# Altium schematic sheet FPGA.schdoc: Kasli-DIOT
size 420 x 297 mm; EDA_Number: ARTIQ; Projet: ARTIQ/SINARA; Author: G.Kasprowicz; CompanyName: WUT ISE; DrawnBy: F.Świtakowski; Organization: WUT ISE; Address1: PW ISE; Address2: Nowowiejska 15/19 00-665 Warsaw; Address3: gkasprow@gmail.com; Revision: 1; SheetNumber: -; SheetTotal: -; ModifiedBy: -; CheckedDate: -; Title2: FPGA; DivGrp: WUT ISE; Designer: F.Świtakowski; ModifiedDate: -; ProjectName: Sensor Box
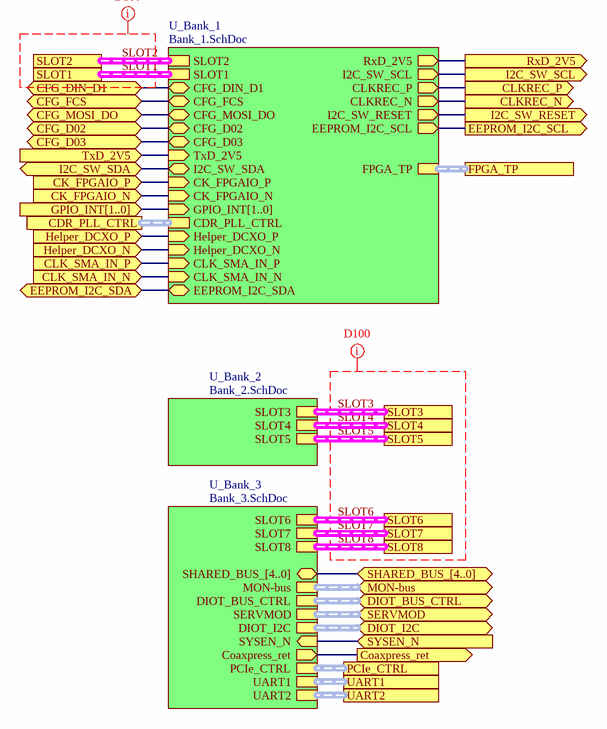
[diagram p0: FPGA.schdoc]

## Sub-sheets
U_Bank_1 = Bank_1.SchDoc: SLOT2 (harness SLOT), SLOT1 (harness SLOT), CFG_DIN_D1 (bidir), CFG_FCS (bidir), CFG_MOSI_DO (bidir), CFG_D02 (bidir), CFG_D03 (bidir), RxD_2V5 (out), TxD_2V5 (in), I2C_SW_SCL (out), I2C_SW_SDA (bidir), CK_FPGAIO_P (in), CK_FPGAIO_N (in), CLKREC_P (out), CLKREC_N (out), GPIO_INT[1..0] (in), CDR_PLL_CTRL (harness CDR_PLL_CTRL), Helper_DCXO_P (in), Helper_DCXO_N (in), I2C_SW_RESET (out), CLK_SMA_IN_P (in), CLK_SMA_IN_N (in), EEPROM_I2C_SDA (bidir), EEPROM_I2C_SCL (out), FPGA_TP (harness FPGA_TESTPOINT)
U_Bank_2 = Bank_2.SchDoc: SLOT3, SLOT4, SLOT5
U_Bank_3 = Bank_3.SchDoc: SLOT6, SLOT7, SLOT8, SHARED_BUS_[4..0] (bidir), MON-bus, DIOT_BUS_CTRL, SERVMOD, DIOT_I2C, SYSEN_N (in), PCIe_CTRL (harness PCIe_CTRL), UART1 (harness UART), UART2 (harness UART), Coaxpress_ret (out)

## Ports
CDR_PLL_CTRL (harness CDR_PLL_CTRL), CFG_D02 (bidir), CFG_D03 (bidir), CFG_DIN_D1 (bidir), CFG_FCS (bidir), CFG_MOSI_DO (bidir), CK_FPGAIO_N (in), CK_FPGAIO_P (in), CLK_SMA_IN_N (in), CLK_SMA_IN_P (in), CLKREC_N (out), CLKREC_P (out), Coaxpress_ret (out), DIOT_BUS_CTRL (bidir), DIOT_I2C (bidir), EEPROM_I2C_SCL (out), EEPROM_I2C_SDA (bidir), FPGA_TP, GPIO_INT[1..0] (in), Helper_DCXO_N (in), Helper_DCXO_P (in), I2C_SW_RESET (out), I2C_SW_SCL (out), I2C_SW_SDA (bidir), MON-bus (bidir), PCIe_CTRL, RxD_2V5 (out), SERVMOD (bidir), SHARED_BUS_[4..0] (bidir), SLOT1, SLOT2, SLOT3, SLOT4, SLOT5, SLOT6, SLOT7, SLOT8, SYSEN_N (in), TxD_2V5 (in), UART1, UART2

## Nets
CFG_D02: port CFG_D02, sheet U_Bank_1/CFG_D02
CFG_D03: port CFG_D03, sheet U_Bank_1/CFG_D03
CFG_DIN_D1: port CFG_DIN_D1, sheet U_Bank_1/CFG_DIN_D1
CFG_FCS: port CFG_FCS, sheet U_Bank_1/CFG_FCS
CFG_MOSI_DO: port CFG_MOSI_DO, sheet U_Bank_1/CFG_MOSI_DO
CK_FPGAIO_N: port CK_FPGAIO_N, sheet U_Bank_1/CK_FPGAIO_N
CK_FPGAIO_P: port CK_FPGAIO_P, sheet U_Bank_1/CK_FPGAIO_P
CLK_SMA_IN_N: port CLK_SMA_IN_N, sheet U_Bank_1/CLK_SMA_IN_N
CLK_SMA_IN_P: port CLK_SMA_IN_P, sheet U_Bank_1/CLK_SMA_IN_P
CLKREC_N: port CLKREC_N, sheet U_Bank_1/CLKREC_N
CLKREC_P: port CLKREC_P, sheet U_Bank_1/CLKREC_P
Coaxpress_ret: port Coaxpress_ret, sheet U_Bank_3/Coaxpress_ret
EEPROM_I2C_SCL: port EEPROM_I2C_SCL, sheet U_Bank_1/EEPROM_I2C_SCL
EEPROM_I2C_SDA: port EEPROM_I2C_SDA, sheet U_Bank_1/EEPROM_I2C_SDA
Helper_DCXO_N: port Helper_DCXO_N, sheet U_Bank_1/Helper_DCXO_N
Helper_DCXO_P: port Helper_DCXO_P, sheet U_Bank_1/Helper_DCXO_P
I2C_SW_RESET: port I2C_SW_RESET, sheet U_Bank_1/I2C_SW_RESET
I2C_SW_SCL: port I2C_SW_SCL, sheet U_Bank_1/I2C_SW_SCL
I2C_SW_SDA: port I2C_SW_SDA, sheet U_Bank_1/I2C_SW_SDA
RxD_2V5: port RxD_2V5, sheet U_Bank_1/RxD_2V5
SYSEN_N: port SYSEN_N, sheet U_Bank_3/SYSEN_N
TxD_2V5: port TxD_2V5, sheet U_Bank_1/TxD_2V5

## Buses and harness runs
bus port GPIO_INT[1..0] = sheet U_Bank_1/GPIO_INT[1..0]
bus port SHARED_BUS_[4..0] = sheet U_Bank_3/SHARED_BUS_[4..0]
harness port CDR_PLL_CTRL = sheet U_Bank_1/CDR_PLL_CTRL
harness port DIOT_BUS_CTRL = sheet U_Bank_3/DIOT_BUS_CTRL
harness port DIOT_I2C = sheet U_Bank_3/DIOT_I2C
harness port FPGA_TP = sheet U_Bank_1/FPGA_TP
harness port MON-bus = sheet U_Bank_3/MON-bus
harness port PCIe_CTRL = sheet U_Bank_3/PCIe_CTRL
harness port SERVMOD = sheet U_Bank_3/SERVMOD
harness port UART1 = sheet U_Bank_3/UART1
harness port UART2 = sheet U_Bank_3/UART2
harness SLOT1 = port SLOT1 = sheet U_Bank_1/SLOT1
harness SLOT2 = port SLOT2 = sheet U_Bank_1/SLOT2
harness SLOT3 = port SLOT3 = sheet U_Bank_2/SLOT3
harness SLOT4 = port SLOT4 = sheet U_Bank_2/SLOT4
harness SLOT5 = port SLOT5 = sheet U_Bank_2/SLOT5
harness SLOT6 = port SLOT6 = sheet U_Bank_3/SLOT6
harness SLOT7 = port SLOT7 = sheet U_Bank_3/SLOT7
harness SLOT8 = port SLOT8 = sheet U_Bank_3/SLOT8

## Layout directives
net class D100: SLOT1, SLOT2, SLOT3, SLOT4, SLOT5, SLOT6, SLOT7, SLOT8

## Notes on the sheet
- Project/Equipment
- Document
- Designer
- Drawn by
- Check.by
- Copyright WUT ISE 2024.
  This documentation describes Open Hardware and is licensed under the CERN OHL v.1.1. You may redistribute and modify this documentation under the terms of the CERN OHL v.1.1. (http://ohwr.org/CERNOHL). This documentation is distributed WITHOUT ANY EXPRESS OR IMPLIED WARRANTY, INCLUDING OF MERCHANTABILITY, SATISFACTORY QUALITY AND FITNESS FOR A PARTICULAR PURPOSE. Please see the CERN OHL v.1.1 for applicable conditions.
- Contact
- File
- Last Mod.
- Print Date
- Sheet
- Size
- A3
- of
- Rev